# EAGLE schematic TresChepes (EAGLE 6.5.0)
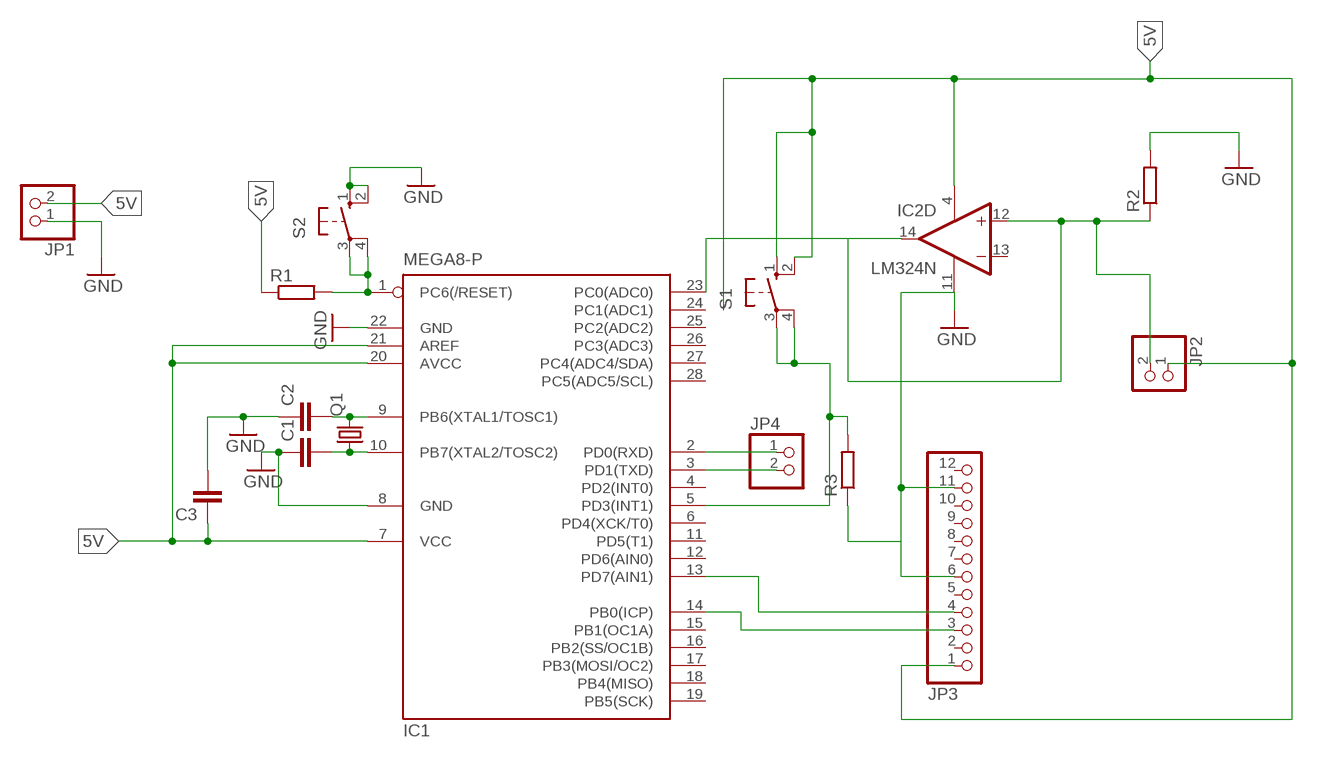
[diagram p0: schematic, sheet 1]

## Parts
C1  C2,5-3  [C2.5-3]
C2  C2,5-3  [C2.5-3]
C3  C2,5-3  [C2.5-3]
IC1  MEGA8-P  [DIL28-3]
IC2  LM324N  [DIL14]
JP1  PINHD-1X2  [1X02]
JP2  PINHD-1X2  [1X02]
JP3  PINHD-1X12  [1X12]
JP4  PINHD-1X2  [1X02]
Q1  CRYSTALTC26V  [TC26V]
R1  R-EU_0204/5  [0204/5]
R2  R-EU_0204/5  [0204/5]
R3  R-EU_0204/5  [0204/5]
S1  10-XX  [B3F-10XX]
S2  10-XX  [B3F-10XX]

## Nets
5V: C3.1 IC1.7(VCC) IC1.20(AVCC) IC1.21(AREF) IC2.4(P:V+) JP1.2 JP2.1 JP3.1 R1.1 S1.1(S) S1.2(S1)
GND: C1.1 C2.1 C3.2 IC1.8(GND) IC1.22(GND) IC2.11(P:V-) JP1.1 JP3.6 JP3.11 R2.2 R3.1 S2.1(S) S2.2(S1)
N$1: IC1.23(PC0(ADC0)) IC2.12(D:+IN) IC2.14(D:OUT) JP2.2 R2.1
N$2: IC1.14(PB0(ICP)) JP3.3
N$3: IC1.13(PD7(AIN1)) JP3.4
N$4: IC1.5(PD3(INT1)) R3.2 S1.3(P) S1.4(P1)
N$5: IC1.3(PD1(TXD)) JP4.2
N$7: IC1.2(PD0(RXD)) JP4.1
N$14: C2.2 IC1.9(PB6(XTAL1/TOSC1)) Q1.2
N$15: C1.2 IC1.10(PB7(XTAL2/TOSC2)) Q1.1
N$16: IC1.1(PC6(/RESET)) R1.2 S2.3(P) S2.4(P1)
Unconnected: IC1.4(PD2(INT0)) IC1.6(PD4(XCK/T0)) IC1.11(PD5(T1)) IC1.12(PD6(AIN0)) IC1.15(PB1(OC1A)) IC1.16(PB2(SS/OC1B)) IC1.17(PB3(MOSI/OC2)) IC1.18(PB4(MISO)) IC1.19(PB5(SCK)) IC1.24(PC1(ADC1)) IC1.25(PC2(ADC2)) IC1.26(PC3(ADC3)) IC1.27(PC4(ADC4/SDA)) IC1.28(PC5(ADC5/SCL)) IC2.1(A:OUT) IC2.2(A:-IN) IC2.3(A:+IN) IC2.5(B:+IN) IC2.6(B:-IN) IC2.7(B:OUT) IC2.8(C:OUT) IC2.9(C:-IN) IC2.10(C:+IN) IC2.13(D:-IN) JP3.2 JP3.5 JP3.7 JP3.8 JP3.9 JP3.10 JP3.12

## Library data of the parts
C1-C3 = capacitor-wima:C: CAPACITOR naming: grid - package width
IC1 = atmel:MEGA8-P: MICROCONTROLLER 8 Kbytes FLASH, 1 kbytes SRAM, 512 bytes EEPROM, USART, 4-channel 10 bit ADC, 2-channel 8 bit ADC Pin compatible with Atmega48, ATMega88, ATMega168 Source: avr.lbr; OC_FARNELL: unknown; OC_NEWARK: unknown
IC2 = linear:LM324: OP AMP
JP1 JP2 JP4 = pinhead:PINHD-1X2: PIN HEADER
JP3 = pinhead:PINHD-1X12: PIN HEADER
Q1 = crystal:CRYSTAL: CRYSTAL; OC_FARNELL: unknown; OC_NEWARK: unknown
R1-R3 = rcl:R-EU_: RESISTOR, European symbol
S1 S2 = switch-omron:10-XX: OMRON SWITCH; MPN: B3F-1000; OC_FARNELL: 176432; OC_NEWARK: 36M3542